# EAGLE design Lynx (EAGLE 6.4)
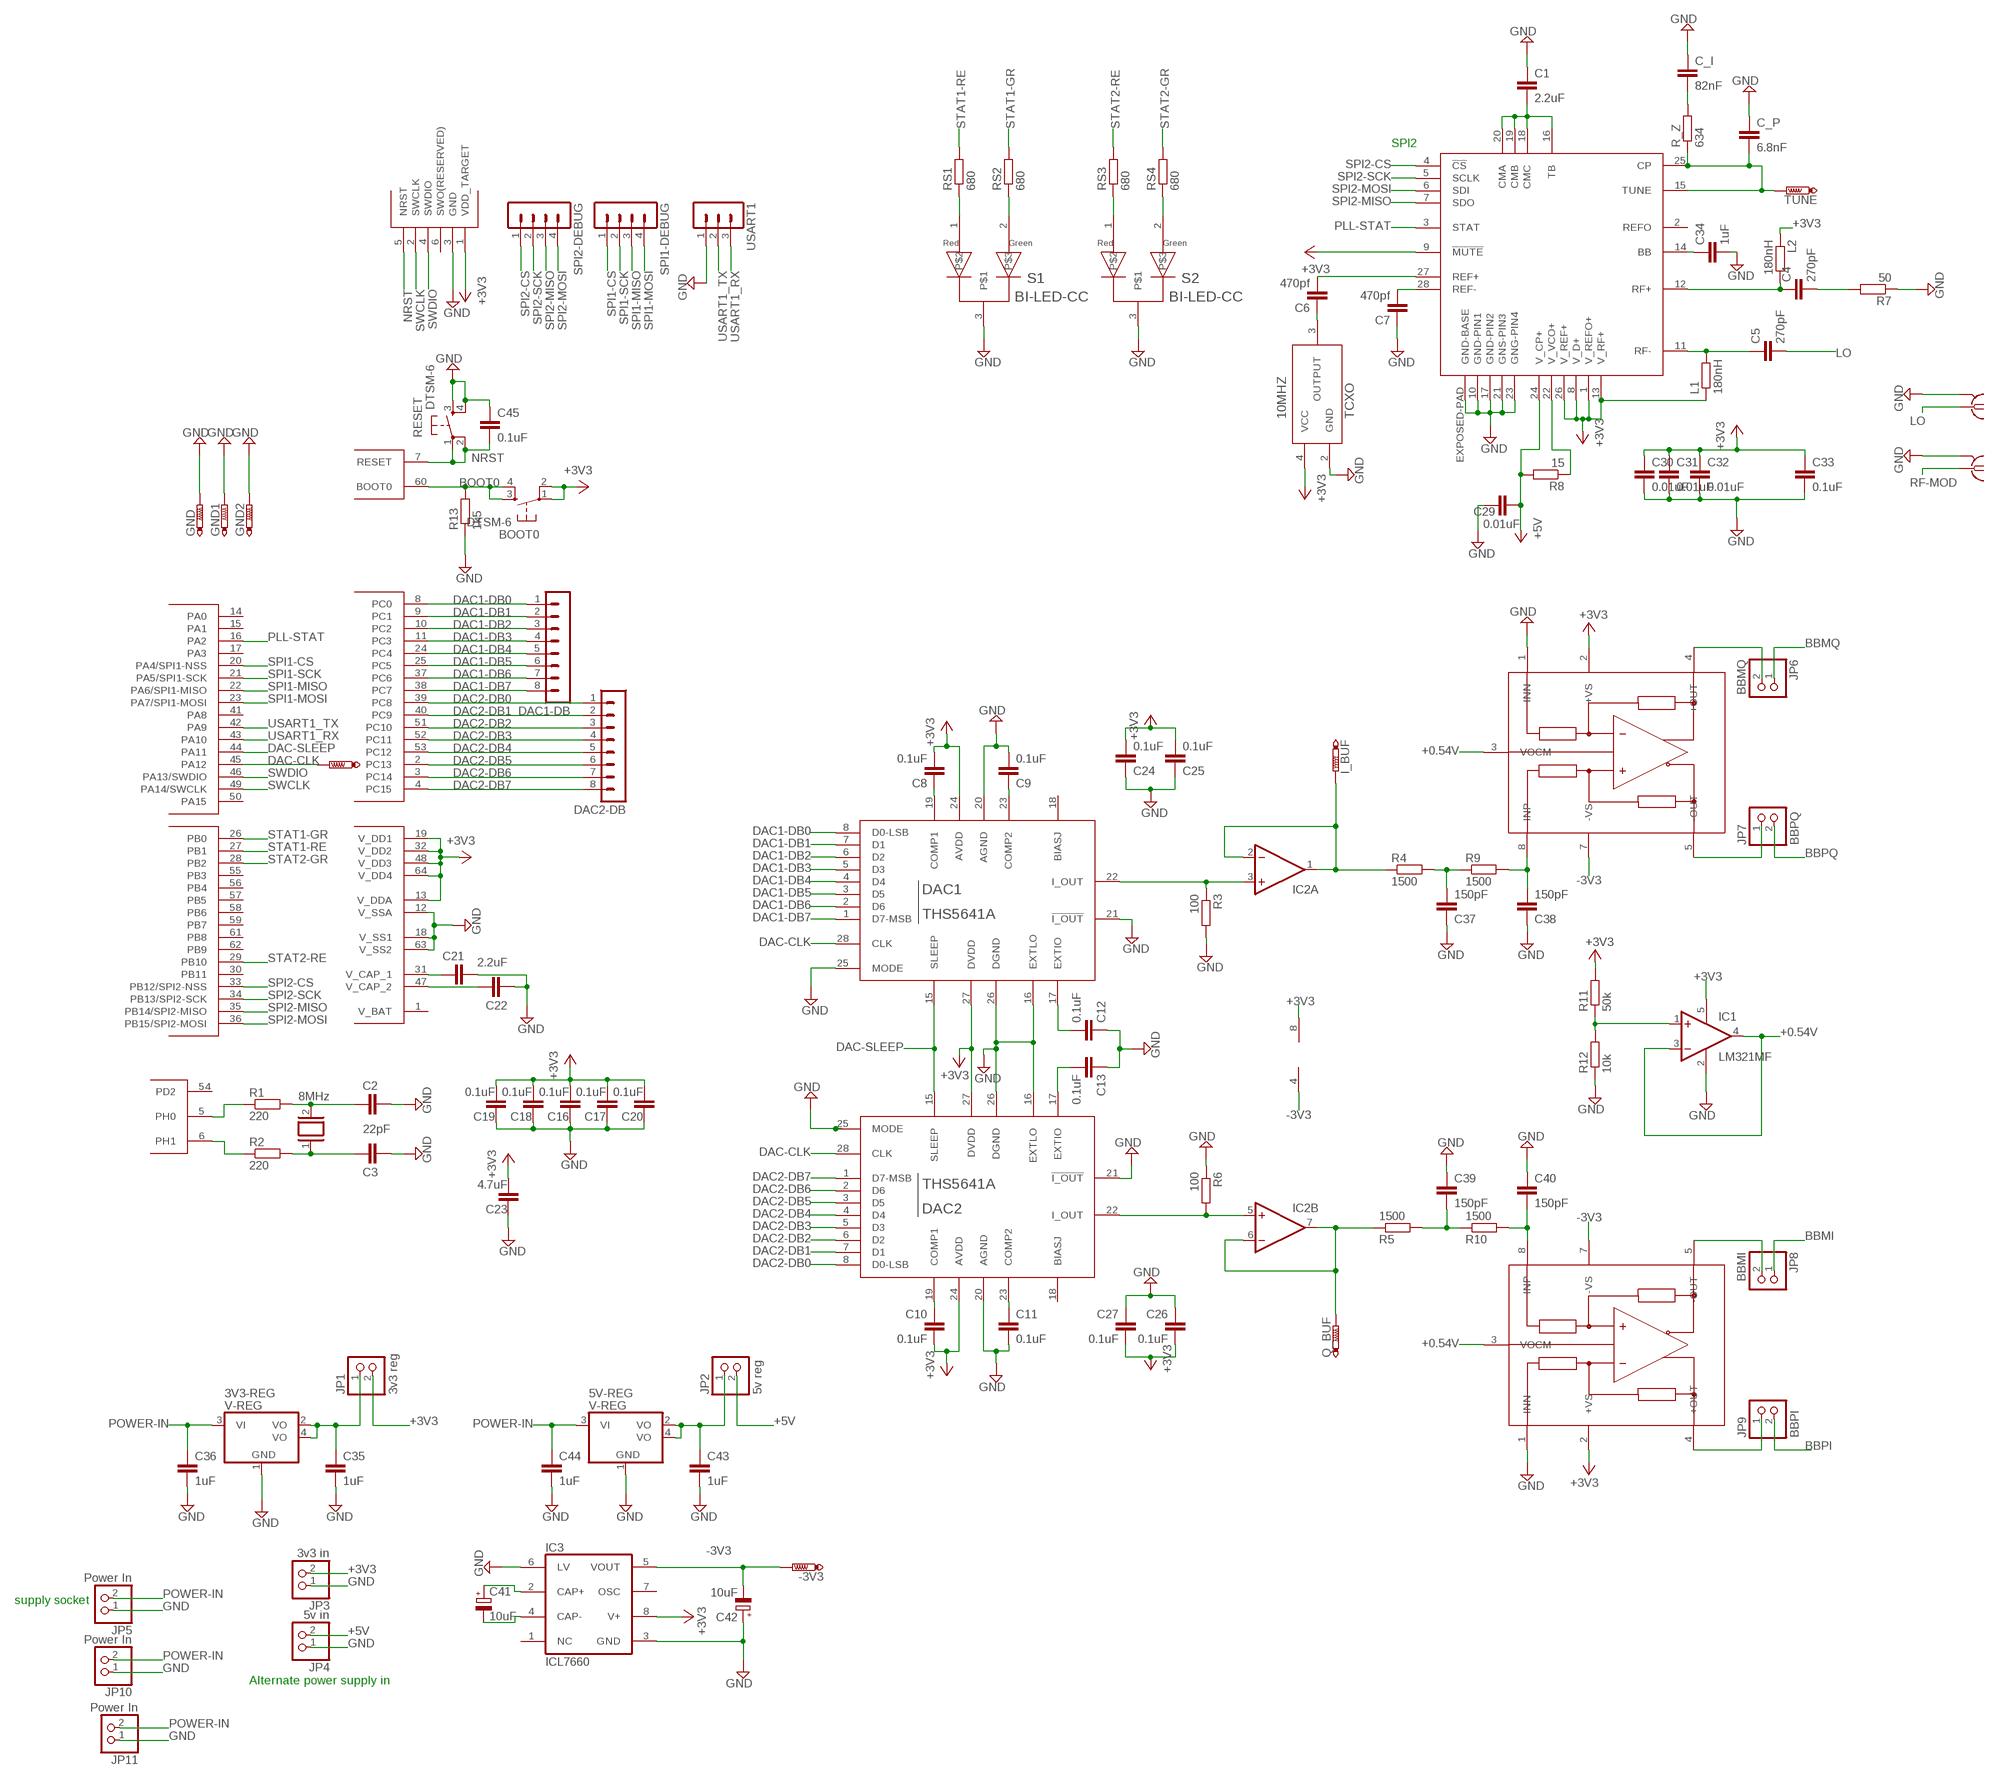
[diagram p0: schematic, sheet 1, part 1 of 2]
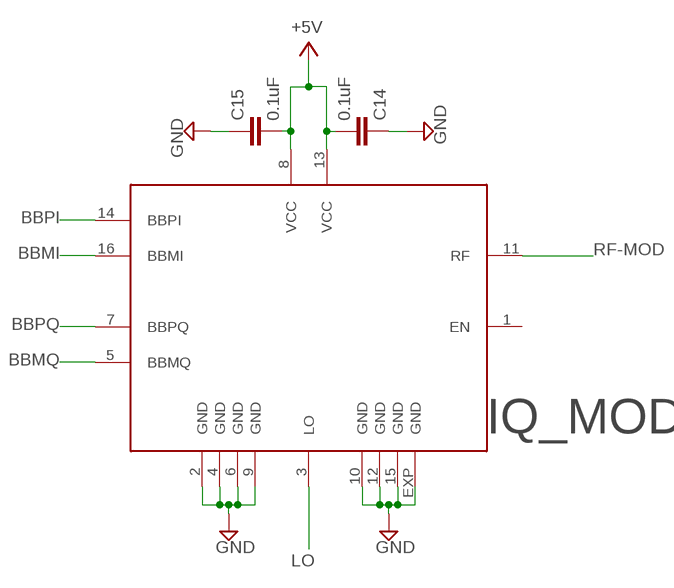
[diagram p1: schematic, sheet 1, part 2 of 2]

## Parts
3V3-REG  V-REG  VOLTAGE-REGULATOR  [SOT223]
5V-REG  V-REG  VOLTAGE-REGULATOR  [SOT223]
10MHZ  TCXO  [TXCO5.6]
-3V3  PTR1PAD1-13Y  [P1-13Y]
BOOT0  DTSM-6  [DTSM-6]
C1  2.2uF  C-EUC0603  [C0603]
C2  22pF  C-EUC0603  [C0603]
C3  22pF  C-EUC0603  [C0603]
C4  270pF  C-EUC0805  [C0805]
C5  270pF  C-EUC0805  [C0805]
C6  470pf  C-EUC0402  [C0402]
C7  470pf  C-EUC0402  [C0402]
C8  0.1uF  C-EUC0603  [C0603]
C9  0.1uF  C-EUC0603  [C0603]
C10  0.1uF  C-EUC0603  [C0603]
C11  0.1uF  C-EUC0603  [C0603]
C12  0.1uF  C-EUC0603  [C0603]
C13  0.1uF  C-EUC0603  [C0603]
C14  0.1uF  C-EUC0603  [C0603]
C15  0.1uF  C-EUC0603  [C0603]
C16  0.1uF  C-EUC0603  [C0603]
C17  0.1uF  C-EUC0603  [C0603]
C18  0.1uF  C-EUC0603  [C0603]
C19  0.1uF  C-EUC0603  [C0603]
C20  0.1uF  C-EUC0603  [C0603]
C21  2.2uF  C-EUC0603  [C0603]
C22  2.2uF  C-EUC0603  [C0603]
C23  4.7uF  C-EUC0603  [C0603]
C24  0.1uF  C-EUC0603  [C0603]
C25  0.1uF  C-EUC0603  [C0603]
C26  0.1uF  C-EUC0603  [C0603]
C27  0.1uF  C-EUC0603  [C0603]
C29  0.01uF  C-EUC0603  [C0603]
C30  0.01uF  C-EUC0603  [C0603]
C31  0.01uF  C-EUC0402  [C0402]
C32  0.01uF  C-EUC0603  [C0603]
C33  0.1uF  C-EUC0603  [C0603]
C34  1uF  C-EUC0603  [C0603]
C35  1uF  C-EUC0603  [C0603]
C36  1uF  C-EUC0603  [C0603]
C37  150pF  C-EUC0603  [C0603]
C38  150pF  C-EUC0603  [C0603]
C39  150pF  C-EUC0603  [C0603]
C40  150pF  C-EUC0603  [C0603]
C41  10uF  CPOL-EUSANYO_SMD_B6  [SANYO-OSCON_SMD_B6]
C42  10uF  CPOL-EUSANYO_SMD_B6  [SANYO-OSCON_SMD_B6]
C43  1uF  C-EUC0603  [C0603]
C44  1uF  C-EUC0603  [C0603]
C45  0.1uF  C-EUC0603  [C0603]
C_I  82nF  C-EUC1210  [C1210]
C_P  6.8nF  C-EUC0805  [C0805]
DAC1  THS5641A  [SO28]
DAC1-DB  MA08-1  [MA08-1]
DAC2  THS5641A  [SO28]
DAC2-DB  MA08-1  [MA08-1]
DAC-CLK  PTR1PAD1-13Y  [P1-13Y]
GND  PTR1PAD1-13Y  [P1-13Y]
GND1  PTR1PAD1-13Y  [P1-13Y]
GND2  PTR1PAD1-13Y  [P1-13Y]
I_BUF  PTR1PAD1-13Y  [P1-13Y]
IC1  LM321MF  [SOT23-5]
IC2  2AMP_P8+4D  [SO08]
IC3  ICL7660  ICL7660CSA  [SO08]
IQ_MOD  LT5568  [QFN-16]
JP1  3v3 reg  PINHD-1X2  [1X02]
JP2  5v reg  PINHD-1X2  [1X02]
JP3  3v3 in  PINHD-1X2  [1X02]
JP4  5v in  PINHD-1X2  [1X02]
JP5  Power In  PINHD-1X2  [1X02]
JP6  BBMQ  PINHD-1X2  [1X02]
JP7  BBPQ  PINHD-1X2  [1X02]
JP8  BBMI  PINHD-1X2  [1X02]
JP9  BBPI  PINHD-1X2  [1X02]
JP10  Power In  PINHD-1X2  [1X02]
JP11  Power In  PINHD-1X2  [1X02]
L1  180nH  R-EU_R0402  [R0402]
L2  180nH  R-EU_R0402  [R0402]
LO  SMA-142-0711-821/826  [J502-ND-142-0711-821/826]
Q1  8MHz  XTAL/S  [QS]
Q_BUF  PTR1PAD1-13Y  [P1-13Y]
R1  220  R-EU_R0603  [R0603]
R2  220  R-EU_R0603  [R0603]
R3  100  R-EU_R0603  [R0603]
R4  1500  R-EU_R0603  [R0603]
R5  1500  R-EU_R0603  [R0603]
R6  100  R-EU_R0603  [R0603]
R7  50  R-EU_R0805  [R0805]
R8  15  R-EU_R0603  [R0603]
R9  1500  R-EU_R0603  [R0603]
R10  1500  R-EU_R0603  [R0603]
R11  50k  R-EU_R0603  [R0603]
R12  10k  R-EU_R0603  [R0603]
R13  1k5  R-EU_R0603  [R0603]
R_Z  634  R-EU_R0805  [R0805]
RESET  DTSM-6  [DTSM-6]
RF-MOD  SMA-142-0711-821/826  [J502-ND-142-0711-821/826]
RS1  680  R-EU_R0603  [R0603]
RS2  680  R-EU_R0603  [R0603]
RS3  680  R-EU_R0603  [R0603]
RS4  680  R-EU_R0603  [R0603]
S1  BI-LED-CC  [SOT-23]
S2  BI-LED-CC  [SOT-23]
SPI1-DEBUG  MA04-1  [MA04-1]
SPI2-DEBUG  MA04-1  [MA04-1]
SWD-HEADER  SWD-HEADER  [6PIN-HEADER]
TUNE  PTR1B1,27  [B1,27]
U$1  STM32F415RGT6  [LQFP-64]
U$3  LTC6946  [QFN-28]
U$4  AD8476  [MSOP8]
U$5  AD8476  [MSOP8]
USART1  MA03-1  [MA03-1]

## Nets
5V-REG: 5V-REG.2(VO) 5V-REG.4(VO) C43.1 JP2.1
+0.54V: IC1.3(-IN) IC1.4(OUT) U$4.3(VOCM) U$5.3(VOCM)
+3V3: 10MHZ.4(VCC) BOOT0.1 BOOT0.2 C8.2 C10.2 C16.2 C17.2 C18.2 C19.2 C20.2 C23.2 C24.2 C25.2 C26.2 C27.2 C30.1 C31.1 C32.1 C33.1 DAC1.24(AVDD) DAC1.27(DVDD) DAC2.24(AVDD) DAC2.27(DVDD) IC1.5(V+) IC2.8(P:V+) IC3.8(V+) JP1.2 JP3.2 L1.1 L2.1 R11.2 SWD-HEADER.1(VDD_TARGET) U$1.13(POWER:V_DDA) U$1.19(POWER:V_DD1) U$1.32(POWER:V_DD2) U$1.48(POWER:V_DD3) U$1.64(POWER:V_DD4) U$3.1(V_REFO+) U$3.8(V_D+) U$3.9(!MUTE!) U$3.13(V_RF+) U$3.26(V_REF+) U$4.2(+VS) U$5.2(+VS)
+5V: C14.2 C15.2 C29.2 IQ_MOD.8(VCC) IQ_MOD.13(VCC) JP2.2 JP4.2 R8.2 U$3.24(V_CP+)
-3V3: -3V3.TP C42.- IC2.4(P:V-) IC3.5(VOUT) U$4.7(-VS) U$5.7(-VS)
BBMI: IQ_MOD.16(BBMI) JP8.1
BBMQ: IQ_MOD.5(BBMQ) JP6.1
BBPI: IQ_MOD.14(BBPI) JP9.2
BBPQ: IQ_MOD.7(BBPQ) JP7.2
BOOT0: BOOT0.3 BOOT0.4 R13.2 U$1.60(FUNCTIONS:BOOT0)
DAC1-DB0: DAC1-DB.1 DAC1.8(D0-LSB) U$1.8(PORT_C:PC0)
DAC1-DB1: DAC1-DB.2 DAC1.7(D1) U$1.9(PORT_C:PC1)
DAC1-DB2: DAC1-DB.3 DAC1.6(D2) U$1.10(PORT_C:PC2)
DAC1-DB3: DAC1-DB.4 DAC1.5(D3) U$1.11(PORT_C:PC3)
DAC1-DB4: DAC1-DB.5 DAC1.4(D4) U$1.24(PORT_C:PC4)
DAC1-DB5: DAC1-DB.6 DAC1.3(D5) U$1.25(PORT_C:PC5)
DAC1-DB6: DAC1-DB.7 DAC1.2(D6) U$1.37(PORT_C:PC6)
DAC1-DB7: DAC1-DB.8 DAC1.1(D7-MSB) U$1.38(PORT_C:PC7)
DAC2-DB0: DAC2-DB.1 DAC2.8(D0-LSB) U$1.39(PORT_C:PC8)
DAC2-DB1: DAC2-DB.2 DAC2.7(D1) U$1.40(PORT_C:PC9)
DAC2-DB2: DAC2-DB.3 DAC2.6(D2) U$1.51(PORT_C:PC10)
DAC2-DB3: DAC2-DB.4 DAC2.5(D3) U$1.52(PORT_C:PC11)
DAC2-DB4: DAC2-DB.5 DAC2.4(D4) U$1.53(PORT_C:PC12)
DAC2-DB5: DAC2-DB.6 DAC2.3(D5) U$1.2(PORT_C:PC13)
DAC2-DB6: DAC2-DB.7 DAC2.2(D6) U$1.3(PORT_C:PC14)
DAC2-DB7: DAC2-DB.8 DAC2.1(D7-MSB) U$1.4(PORT_C:PC15)
DAC-CLK: DAC1.28(CLK) DAC2.28(CLK) DAC-CLK.TP U$1.45(PORT_A:PA12)
DAC-SLEEP: DAC1.15(SLEEP) DAC2.15(SLEEP) U$1.44(PORT_A:PA11)
GND: 3V3-REG.1(GND) 5V-REG.1(GND) 10MHZ.2(GND) C1.1 C2.2 C3.2 C7.1 C9.2 C11.2 C12.1 C13.1 C14.1 C15.1 C16.1 C17.1 C18.1 C19.1 C20.1 C21.2 C22.2 C23.1 C24.1 C25.1 C26.1 C27.1 C29.1 C30.2 C31.2 C32.2 C33.2 C34.2 C35.2 C36.2 C37.1 C38.1 C39.1 C40.1 C42.+ C43.2 C44.2 C45.1 C_I.1 C_P.1 DAC1.16(EXTLO) DAC1.20(AGND) DAC1.21(!I_OUT!) DAC1.25(MODE) DAC1.26(DGND) DAC2.16(EXTLO) DAC2.20(AGND) DAC2.21(!I_OUT!) DAC2.25(MODE) DAC2.26(DGND) GND1.TP GND2.TP GND.TP IC1.2(V-) IC3.3(GND) IC3.6(LV) IQ_MOD.2(GND) IQ_MOD.4(GND) IQ_MOD.6(GND) IQ_MOD.9(GND) IQ_MOD.10(GND) IQ_MOD.12(GND) IQ_MOD.15(GND) IQ_MOD.EXP(GND) JP3.1 JP4.1 JP5.1 JP10.1 JP11.1 LO.G@1 LO.G@2 LO.G@3 LO.G@4 R3.2 R6.1 R7.1 R12.1 R13.1 RESET.3 RESET.4 RF-MOD.G@1 RF-MOD.G@2 RF-MOD.G@3 RF-MOD.G@4 S1.3 S2.3 SWD-HEADER.3(GND) U$1.12(POWER:V_SSA) U$1.18(POWER:V_SS1) U$1.63(POWER:V_SS2) U$3.10(GND-PIN1) U$3.17(GND-PIN2) U$3.21(GNS-PIN3) U$3.23(GNG-PIN4) U$3.EXPOSED-PAD(GND-BASE) U$4.1(INN) U$5.1(INN) USART1.1
I_BUF: I_BUF.TP IC2.1(A:OUT) IC2.2(A:-IN) R4.1
LO: C5.2 IQ_MOD.3(LO) LO.1
N$1: C_P.2 R_Z.1 TUNE.TP U$3.15(TUNE) U$3.25(CP)
N$2: C1.2 U$3.16(TB) U$3.18(CMC) U$3.19(CMB) U$3.20(CMA)
N$3: C7.2 U$3.28(REF-)
N$4: C3.1 Q1.1 R2.2
N$5: C2.1 Q1.2 R1.2
N$6: R1.1 U$1.5(PH0)
N$7: R2.1 U$1.6(PH1)
N$8: C5.1 L1.2 U$3.11(RF-)
N$10: C4.2 R7.2
N$11: C13.2 DAC2.17(EXTIO)
N$12: C8.1 DAC1.19(COMP1)
N$13: C12.2 DAC1.17(EXTIO)
N$14: DAC1.22(I_OUT) IC2.3(A:+IN) R3.1
N$15: JP6.2 U$4.4(+OUT)
N$16: RS1.1 S1.1
N$17: RS2.1 S1.2
N$18: RS3.1 S2.1
N$19: RS4.1 S2.2
N$20: C10.1 DAC2.19(COMP1)
N$21: C6.2 U$3.27(REF+)
N$22: 10MHZ.3(OUTPUT) C6.1
N$23: C_I.2 R_Z.2
N$24: C9.1 DAC1.23(COMP2)
N$25: C11.1 DAC2.23(COMP2)
N$26: C21.1 U$1.31(POWER:V_CAP_1)
N$27: C22.1 U$1.47(POWER:V_CAP_2)
N$28: JP7.1 U$4.5(-OUT)
N$29: DAC2.22(I_OUT) IC2.5(B:+IN) R6.2
N$30: R8.1 U$3.22(V_VCO+)
N$31: C37.2 R4.2 R9.1
N$32: C38.2 R9.2 U$4.8(INP)
N$33: C34.1 U$3.14(BB)
N$34: C41.- IC3.4(CAP-)
N$35: C39.2 R5.2 R10.1
N$36: C40.2 R10.2 U$5.8(INP)
N$37: C41.+ IC3.2(CAP+)
N$38: 3V3-REG.2(VO) 3V3-REG.4(VO) C35.1 JP1.1
N$39: JP8.2 U$5.5(-OUT)
N$40: JP9.1 U$5.4(+OUT)
N$42: IC1.1(+IN) R11.1 R12.2
NRST: C45.2 RESET.1 RESET.2 SWD-HEADER.5(NRST) U$1.7(FUNCTIONS:RESET)
PLL-STAT: U$1.16(PORT_A:PA2) U$3.3(STAT)
POWER-IN: 3V3-REG.3(VI) 5V-REG.3(VI) C36.1 C44.1 JP5.2 JP10.2 JP11.2
Q_BUF: IC2.6(B:-IN) IC2.7(B:OUT) Q_BUF.TP R5.1
RF+: C4.1 L2.2 U$3.12(RF+)
RF-MOD: IQ_MOD.11(RF) RF-MOD.1
SPI1-CS: SPI1-DEBUG.1 U$1.20(PORT_A:PA4/SPI1-NSS)
SPI1-MISO: SPI1-DEBUG.3 U$1.22(PORT_A:PA6/SPI1-MISO)
SPI1-MOSI: SPI1-DEBUG.4 U$1.23(PORT_A:PA7/SPI1-MOSI)
SPI1-SCK: SPI1-DEBUG.2 U$1.21(PORT_A:PA5/SPI1-SCK)
SPI2-CS: SPI2-DEBUG.1 U$1.33(PORT_B:PB12/SPI2-NSS) U$3.4(!CS!)
SPI2-MISO: SPI2-DEBUG.3 U$1.35(PORT_B:PB14/SPI2-MISO) U$3.7(SDO)
SPI2-MOSI: SPI2-DEBUG.4 U$1.36(PORT_B:PB15/SPI2-MOSI) U$3.6(SDI)
SPI2-SCK: SPI2-DEBUG.2 U$1.34(PORT_B:PB13/SPI2-SCK) U$3.5(SCLK)
STAT1-GR: RS2.2 U$1.26(PORT_B:PB0)
STAT1-RE: RS1.2 U$1.27(PORT_B:PB1)
STAT2-GR: RS4.2 U$1.28(PORT_B:PB2)
STAT2-RE: RS3.2 U$1.29(PORT_B:PB10)
SWCLK: SWD-HEADER.2(SWCLK) U$1.49(PORT_A:PA14/SWCLK)
SWDIO: SWD-HEADER.4(SWDIO) U$1.46(PORT_A:PA13/SWDIO)
USART1_RX: U$1.43(PORT_A:PA10) USART1.3
USART1_TX: U$1.42(PORT_A:PA9) USART1.2
Unconnected: DAC1.18(BIASJ) DAC2.18(BIASJ) IC3.1(NC) IC3.7(OSC) IQ_MOD.1(EN) SWD-HEADER.6(SWO(RESERVED)) U$1.1(POWER:V_BAT) U$1.14(PORT_A:PA0) U$1.15(PORT_A:PA1) U$1.17(PORT_A:PA3) U$1.30(PORT_B:PB11) U$1.41(PORT_A:PA8) U$1.50(PORT_A:PA15) U$1.54(PD2) U$1.55(PORT_B:PB3) U$1.56(PORT_B:PB4) U$1.57(PORT_B:PB5) U$1.58(PORT_B:PB6) U$1.59(PORT_B:PB7) U$1.61(PORT_B:PB8) U$1.62(PORT_B:PB9) U$3.2(REFO)

## Notes on the sheet
- SPI2
- supply socket
- Alternate power supply in

## Library data of the parts
3V3-REG 5V-REG = Lynx components:VOLTAGE-REGULATOR
10MHZ = Lynx components:TCXO
-3V3 DAC-CLK GND GND1 GND2 I_BUF Q_BUF TUNE = testpad:PTR1: TEST PIN
BOOT0 RESET = switch-tact:DTSM-6
C1 C4-C20 C23-C27 C29-C40 C43-C45 C_I = rcl:C-EU: CAPACITOR, European symbol
C2 C3 C21 C22 C_P = resistor:C-EU: CAPACITOR, European symbol
C41 C42 = rcl:CPOL-EU: POLARIZED CAPACITOR, European symbol
DAC1 DAC2 = Lynx components:THS5641A
DAC1-DB DAC2-DB = con-lstb:MA08-1: PIN HEADER; OC_FARNELL: unknown; OC_NEWARK: unknown
IC1 = linear:LM321?*: Low Power Single Op Amp Source: http://cache.national.com/ds/LM/LM321.pdf
IC2 = linear:2AMP_P8+4: OP AMP
IC3 = maxim:ICL7660CSA: VOLTAGE CONVERTER; MF: MAXIM; MPN: ICL7660CSA; OC_FARNELL: 9724710; OC_NEWARK: 34C3732
IQ_MOD = Lynx components:LT5568
JP1-JP11 = pinhead:PINHD-1X2: PIN HEADER
L1 L2 R7 R8 R_Z = rcl:R-EU_: RESISTOR, European symbol
LO RF-MOD = con-coax:SMA-: SMA 50 Ohm End Launch Jack Receptacle - Round Contact Johnson Components Source: www.johnsoncomponents.com .. J502-ND.pdf; MF: JOHNSON COMPONENTS; MPN: 142-0711-821; OC_FARNELL: 1019328; OC_NEWARK: 16F3627
Q1 = special:XTAL/S: CRYSTAL
R1-R6 R9-R13 RS1-RS4 = resistor:R-EU_: RESISTOR, European symbol
S1 S2 = Lynx components:BI-LED-CC
SPI1-DEBUG SPI2-DEBUG = con-lstb:MA04-1: PIN HEADER; OC_FARNELL: unknown; OC_NEWARK: unknown
SWD-HEADER = Lynx components:SWD-HEADER
U$1 = Lynx components:STM32F415RGT6
U$3 = Lynx components:LTC6946
U$4 U$5 = Lynx components:AD8476
USART1 = con-lstb:MA03-1: PIN HEADER; OC_FARNELL: unknown; OC_NEWARK: unknown

## Board
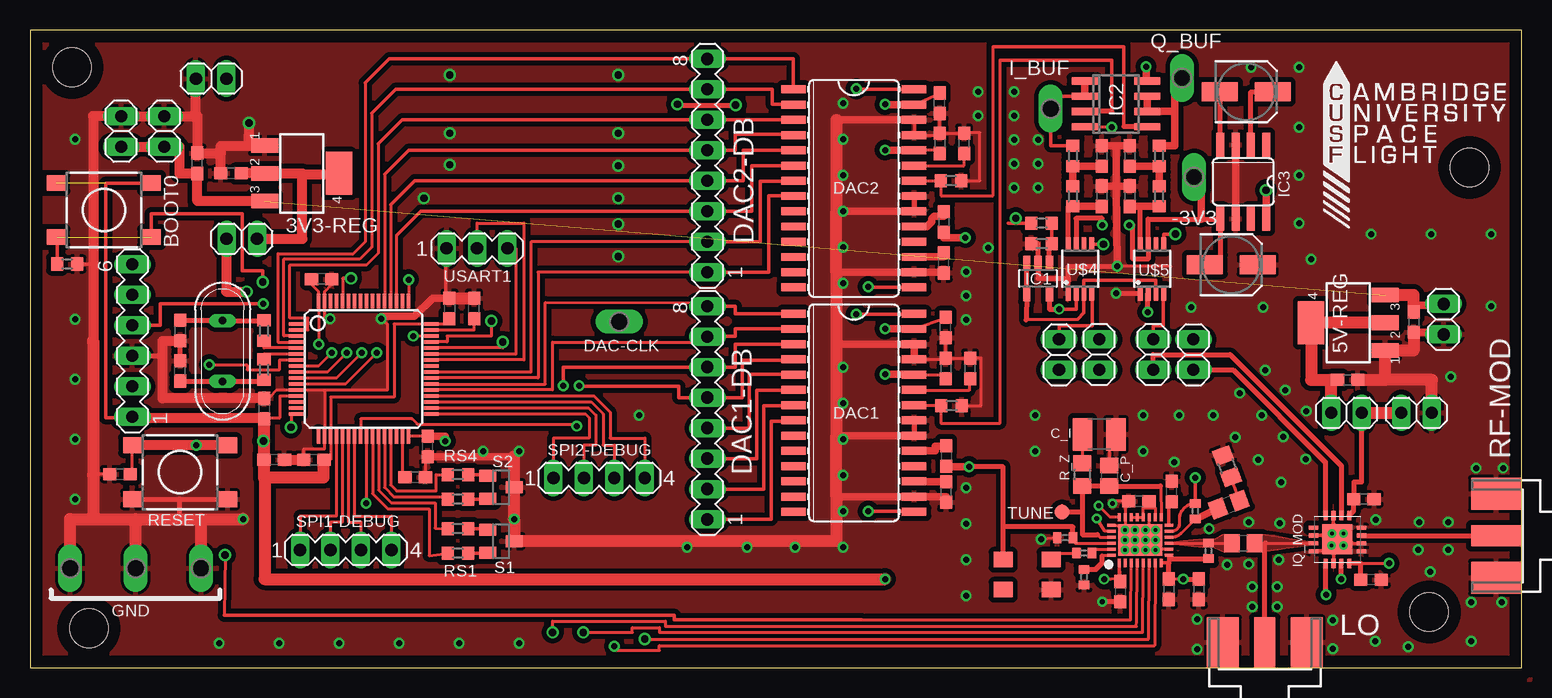
[diagram p2: board, top side]
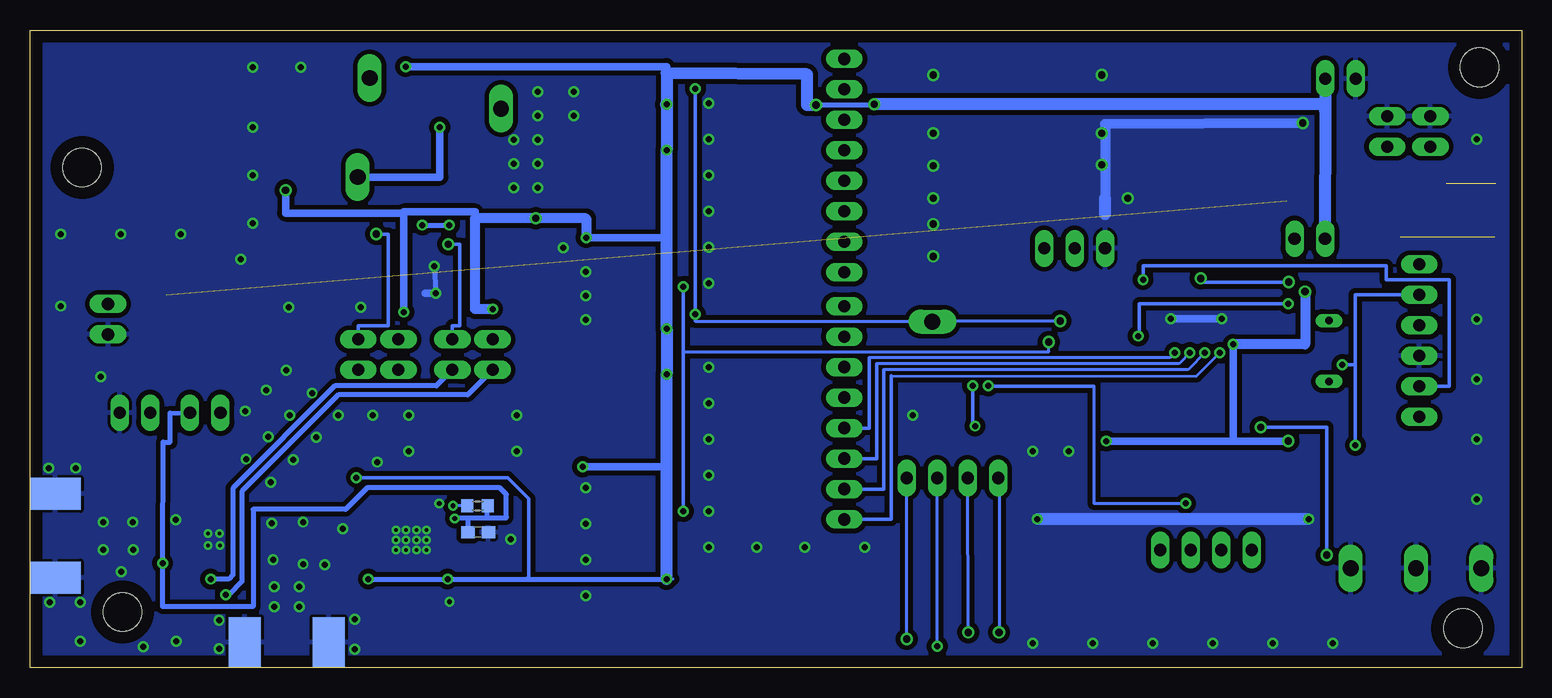
[diagram p3: board, bottom side, seen from below]

Size 124.3 x 53.15 mm. Coordinates in mm from the lower left corner, seen from the top.
Outline: 0,0 124.3,0 124.3,53.15 0,53.15 0,0
Copper layers (1*16): Top 0.035mm / dielectric 1.5mm / Bottom 0.035mm
Design rules "default *": minimum track width 0.2mm, minimum drill 0.2mm, track to track 0.2mm, track to pad 0.2mm, pad to pad 0.2mm, via to via 0.25mm, smd to smd 5mil, copper to edge 40mil, drill to drill 8mil, minimum pad ring 10mil, minimum via ring 8mil, stop-mask expansion 4mil, vias tented up to drill 0mil, thermal gap 10mil
Holes 3.2 mm at 4.9,3.3 119.95,41.7 116.6,4.65 3.5,50.05

### Footprints (pad centres in the part's own frame; a part is rotated, then mirrored left to right if it is on the bottom)
SOT223 = smd 1.219 x 2.235: 1 -2.311,-3.099; 2 0,-3.099; 3 2.311,-3.099 | smd 3.6 x 2.2: 4 0,3.099
TXCO5.6 = smd 1.6 x 1.3: 1 -2,-1.25; 2 2,-1.25; 3 2,1.25; 4 -2,1.25
P1-13Y = drill 1.321 pad 1.905 long: TP 0,0
DTSM-6 = smd 1.55 x 1.3: 1 -3.975,2.25; 2 3.975,2.25; 3 -3.975,-2.25; 4 3.975,-2.25
C0603 = smd 1.1 x 1: 1 -0.85,0; 2 0.85,0
C0805 = smd 1.3 x 1.5: 1 -0.95,0; 2 0.95,0
C0402 = smd 0.7 x 0.9: 1 -0.65,0; 2 0.65,0
SANYO-OSCON_SMD_B6 = smd 3 x 1.6: + 2.2,0; - -2.2,0
C1210 = smd 1.6 x 2.7: 1 -1.4,0; 2 1.4,0
C0805' = smd 1.3 x 1.5: 1 -0.85,0; 2 0.85,0
SO28 = smd 0.66 x 2.032: 1 -8.255,-5.029; 2 -6.985,-5.029; 3 -5.715,-5.029; 4 -4.445,-5.029; 5 -3.175,-5.029; 6 -1.905,-5.029; 7 -0.635,-5.029; 8 0.635,-5.029; 9 1.905,-5.029; 10 3.175,-5.029; 11 4.445,-5.029; 12 5.715,-5.029; 13 6.985,-5.029; 14 8.255,-5.029; 15 8.255,5.029; 16 6.985,5.029; 17 5.715,5.029; 18 4.445,5.029; 19 3.175,5.029; 20 1.905,5.029; 21 0.635,5.029; 22 -0.635,5.029; 23 -1.905,5.029; 24 -3.175,5.029; 25 -4.445,5.029; 26 -5.715,5.029; 27 -6.985,5.029; 28 -8.255,5.029
MA08-1 = drill 1.016 long: 1 -8.89,0; 2 -6.35,0; 3 -3.81,0; 4 -1.27,0; 5 1.27,0; 6 3.81,0; 7 6.35,0; 8 8.89,0
SOT23-5 = smd 0.6 x 1.2: 1 -0.95,-1.306; 2 0,-1.306; 3 0.95,-1.306; 4 0.95,1.306; 5 -0.95,1.306
SO08 = smd 0.6 x 2.2: 1 -1.905,-2.6; 2 -0.635,-2.6; 3 0.635,-2.6; 4 1.905,-2.6; 5 1.905,2.6; 6 0.635,2.6; 7 -0.635,2.6; 8 -1.905,2.6
SO08' = smd 0.66 x 2.032: 1 -1.905,-3.073; 2 -0.635,-3.073; 3 0.635,-3.073; 4 1.905,-3.073; 5 1.905,3.073; 6 0.635,3.073; 7 -0.635,3.073; 8 -1.905,3.073
QFN-16 = smd 0.8 x 0.35: 1 -2,0.975; 2 -2,0.325; 3 -2,-0.325; 4 -2,-0.975; 9 2,-0.975; 10 2,-0.325; 11 2,0.325; 12 2,0.975 | smd 0.35 x 0.8: 5 -0.975,-2; 6 -0.325,-2; 7 0.325,-2; 8 0.975,-2; 13 0.975,2; 14 0.325,2; 15 -0.325,2; 16 -0.975,2 | smd 2.5 x 2.5: EXP 0,0
1X02 = drill 1.016 long: 1 -1.27,0; 2 1.27,0
R0402 = smd 0.7 x 0.9: 1 -0.65,0; 2 0.65,0
J502-ND-142-0711-821/826 = smd 4.191 x 1.778: 1 2.115,0 | smd 4.191 x 2.667: G@1 2.115,3.495; G@2 2.115,-3.495 | smd 4.191 x 2.667 bottom: G@3 2.115,3.495; G@4 2.115,-3.495
QS = drill 0.61 long: 1 -2.54,0; 2 2.54,0
R0603 = smd 1 x 1.1: 1 -0.85,0; 2 0.85,0
R0805 = smd 1.3 x 1.5: 1 -0.95,0; 2 0.95,0
SOT-23 = smd 1 x 1.4: 1 -0.95,-1.1; 2 0.95,-1.1; 3 0,1.1
MA04-1 = drill 1.016 long: 1 -3.81,0; 2 -1.27,0; 3 1.27,0; 4 3.81,0
6PIN-HEADER = drill 1.016 long: 1 -6.35,0; 2 -3.81,0; 3 -1.27,0; 4 1.27,0; 5 3.81,0; 6 6.35,0
B1,27 = smd 1.27 x 1.27: TP 0,0
LQFP-64 = smd 1.2 x 0.3: 1 -5.65,3.75; 2 -5.65,3.25; 3 -5.65,2.75; 4 -5.65,2.25; 5 -5.65,1.75; 6 -5.65,1.25; 7 -5.65,0.75; 8 -5.65,0.25; 9 -5.65,-0.25; 10 -5.65,-0.75; 11 -5.65,-1.25; 12 -5.65,-1.75; 13 -5.65,-2.25; 14 -5.65,-2.75; 15 -5.65,-3.25; 16 -5.65,-3.75; 33 5.65,-3.75; 34 5.65,-3.25; 35 5.65,-2.75; 36 5.65,-2.25; 37 5.65,-1.75; 38 5.65,-1.25; 39 5.65,-0.75; 40 5.65,-0.25; 41 5.65,0.25; 42 5.65,0.75; 43 5.65,1.25; 44 5.65,1.75; 45 5.65,2.25; 46 5.65,2.75; 47 5.65,3.25; 48 5.65,3.75 | smd 0.3 x 1.2: 17 -3.75,-5.65; 18 -3.25,-5.65; 19 -2.75,-5.65; 20 -2.25,-5.65; 21 -1.75,-5.65; 22 -1.25,-5.65; 23 -0.75,-5.65; 24 -0.25,-5.65; 25 0.25,-5.65; 26 0.75,-5.65; 27 1.25,-5.65; 28 1.75,-5.65; 29 2.25,-5.65; 30 2.75,-5.65; 31 3.25,-5.65; 32 3.75,-5.65; 49 3.75,5.65; 50 3.25,5.65; 51 2.75,5.65; 52 2.25,5.65; 53 1.75,5.65; 54 1.25,5.65; 55 0.75,5.65; 56 0.25,5.65; 57 -0.25,5.65; 58 -0.75,5.65; 59 -1.25,5.65; 60 -1.75,5.65; 61 -2.25,5.65; 62 -2.75,5.65; 63 -3.25,5.65; 64 -3.75,5.65
QFN-28 = smd 0.25 x 0.7: 1 -1.83,-1.9; 2 -1.33,-1.9; 3 -0.83,-1.9; 4 -0.33,-1.9; 5 0.17,-1.9; 6 0.67,-1.9; 7 1.17,-1.9; 8 1.67,-1.9; 15 1.67,1.9; 16 1.17,1.9; 17 0.67,1.9; 18 0.17,1.9; 19 -0.33,1.9; 20 -0.83,1.9; 21 -1.33,1.9; 22 -1.83,1.9 | smd 0.7 x 0.25: 9 2.32,-1.25; 10 2.32,-0.75; 11 2.32,-0.25; 12 2.32,0.25; 13 2.32,0.75; 14 2.32,1.25; 23 -2.48,1.25; 24 -2.48,0.75; 25 -2.48,0.25; 26 -2.48,-0.25; 27 -2.48,-0.75; 28 -2.48,-1.25 | smd 3.65 x 2.65: EXPOSED-PAD -0.07,0
MSOP8 = smd 0.4 x 1.2: 1 -0.975,-2.05; 2 -0.325,-2.05; 3 0.325,-2.05; 4 0.975,-2.05; 5 0.975,2.05; 6 0.325,2.05; 7 -0.325,2.05; 8 -0.975,2.05
MA03-1 = drill 1.016 long: 1 -2.54,0; 2 0,0; 3 2.54,0

### Placement (x,y rotation side)
3V3-REG  22.65,41.2 270 top
5V-REG  109.85,28.75 90 top
10MHZ  83.09,7.76 0 top
-3V3  97,40.9 0 top
BOOT0  6.15,38.15 0 top
C1  92.4,13.9 0 top
C2  12.5,28.1 270 top
C3  12.5,24.75 90 top
C4  99.9,13.6 20 top
C5  101.1,10.4 0 top
C6  87.84,9.56 0 top
C7  87.84,7.54 90 top
C8  76.35,17.65 270 top
C9  78.35,24.95 90 top
C10  76.15,37.15 270 top
C11  77.85,43.7 90 top
C12  76.35,14.65 90 top
C13  76.15,33.75 90 top
C14  111.15,14.05 180 top
C15  111.75,7.35 180 top
C16  24.3,32.4 180 top
C17  34.95,29.95 270 top
C18  23.65,17.35 0 top
C19  33.15,18.45 90 top
C20  19.5,21.6 270 top
C21  32.1,15.9 0 top
C22  37,29.95 90 top
C23  20.35,17.35 180 top
C24  76.3,24.95 270 top
C25  76.3,28.35 90 top
C26  75.8,43.7 270 top
C27  75.8,47.05 90 top
C29  86.95,11.3 180 bottom
C30  94.9,6.55 270 top
C31  86.25,10.85 180 top
C32  90.85,6.35 270 top
C33  97.4,6.55 270 top
C34  95.15,14.7 90 top
C35  16.75,41.2 180 top
C36  13.95,42.05 90 top
C37  89.3,42.65 270 top
C38  89.3,39.3 270 top
C39  91.65,42.65 270 top
C40  91.65,39.3 270 top
C41  101.35,48 0 top
C42  100.1,33.6 0 top
C43  109.8,24 0 top
C44  115.3,28.8 270 top
C45  7.5,16.15 0 top
C_I  89.1,19.45 180 top
C_P  6.8nF  [C0805']  89.95,16 270 top
DAC1  68.65,21.25 270 top
DAC1-DB  56.45,21.25 90 top
DAC2  68.65,39.95 270 top
DAC2-DB  56.45,41.85 90 top
DAC-CLK  49.1,28.85 90 top
GND  14.25,8.3 0 top
GND1  8.8,8.3 0 top
GND2  3.35,8.3 0 top
I_BUF  85.05,46.6 0 top
IC1  84,32.45 180 top
IC2  90.5,47 270 top
IC3  ICL7660  [SO08']  101.1,40.5 180 top
IQ_MOD  108.95,10.7 0 top
JP1  17.65,35.75 180 top
JP2  109.7,21.25 0 top
JP3  15.1,49.1 0 top
JP4  115.55,21.25 180 top
JP5  7.6,44.7 270 top
JP6  85.75,26.1 90 top
JP7  89.1,26.1 270 top
JP8  96.95,26.1 90 top
JP9  93.6,26.1 270 top
JP10  117.8,29.05 90 top
JP11  11.2,44.7 270 top
L1  98.2,9.75 90 top
L2  97.1,13.05 270 top
LO  102.9,0 90 top
Q1  16.05,26.4 90 top
Q_BUF  96,49.15 0 top
R1  19.5,28.1 90 top
R2  19.5,24.85 270 top
R3  76.8,21.85 0 top
R4  86.9,42.65 270 top
R5  94.1,42.65 270 top
R6  76.75,40.6 180 top
R7  99.75,16.8 290 top
R8  87,13.5 0 bottom
R9  86.9,39.3 270 top
R10  94.1,39.3 270 top
R11  84.3,37.05 180 top
R12  84.3,35.35 0 top
R13  3.1,33.65 180 top
R_Z  87.7,16.1 90 top
RESET  12.5,16.3 0 top
RF-MOD  124.3,11 180 top
RS1  35.65,11.6 180 top
RS2  35.65,9.55 180 top
RS3  35.65,16.1 180 top
RS4  35.65,14.05 180 top
S1  39.25,10.55 270 top
S2  39.25,15.05 270 top
SPI1-DEBUG  26.31,9.82 0 top
SPI2-DEBUG  47.43,15.82 0 top
SWD-HEADER  8.53,27.27 90 top
TUNE  86,13 0 top
U$1  27.8,24.91 0 top
U$2  [CUSF_LOGO]  107.6,36.55 0 top
U$3  92.59,10.65 0 top
U$4  87.5,33.25 0 top
U$5  93.5,33.25 0 top
USART1  37.25,34.95 0 top

### Tracks (layer width: path | path; a pad name or v marks a point on that pad's centre or on a via)
5V-REG
  Top 1.016: 5V-REG.2 5V-REG.4 106.75,24 108.43,24 | 108.43,24 C43.1 | JP2.1 108.43,24
+0.54V
  Top 0.305: U$5.3 93.83,32.3 87.83,32.3 U$4.3 87.83,29.57 87.3,29.05 83,29
  Top 0.406: IC1.3 IC1.4 83,29
+3V3  (via drill 0.5, 0.6)  (1 unrouted)
  Top 0.254: 19.55,20.85 20.85,20.85 20.85,22.66 U$1.13 | C18.2 25.05,17.35 U$1.19 25.05,22.55 30.35,22.55 30.35,28.65 34.65,28.65 34.65,28.66 | C19.2 31.55,19.3 U$1.32 | U$1.48 34.65,28.66 | v24.05,26.95 U$1.64 24.05,31.35 23.45,31.95 C16.2 | C17.2 34.65,28.66 | C26.2 75.8,43.12 DAC2.24 | DAC2.27 75.8,47.88 C27.2 | DAC1.27 76.3,29.18 C25.2 | DAC1.24 76.3,24.43 C24.2 | C32.1 90.76,7.65 U$3.1 90.81,7.41 90.1,7.4 v89.5,7.4 | C31.1 87.1,10.4 U$3.26 | U$3.13 95.16,11.4 arc90 95.8,12.04 95.8,12.4 arc-90 L2.1 | v96.1,7.4 C30.1
  Top 0.305: C8.2 76.35,16.75 | 73.68,24.45 DAC1.24 | DAC1.27 73.68,28.25 | C10.2 76.15,35.85 | 73.68,43.15 DAC2.24 | 71.25,46.94 v71.25,46.95 | C18.2 24.45,17.35 | BOOT0.2 6.3,40.4 6.3,20.85 8.53,20.85 | 81.5,37.05 R11.2 82.15,37.05 v82.15,37.45 | v85.75,29.9 87.17,29.9 U$4.2 | U$3.8 94.91,8.75 U$3.9 94.95,9.4 94.95,9.1 | C30.1 94.91,7.65 | L2.1 v97.1,15.85
  Top 0.406: 34.6,19.3 v34.6,18.9 | 19.65,19.25 19.5,19.15 | U$4.2 87.17,30.85 | v93.15,29.65 93.15,31.2 U$5.2 | IC2.8 93,48.91 | v53.95,46.95 53.95,46.9 v58.8,46.9 | 8.55,20.85 8.53,20.85 SWD-HEADER.1 | 94.91,7.65 94.91,8.75 | 94.95,9.1 L1.1 | 10MHZ.4 81.09,11.75 | 81.09,11.75 81.09,16.75 v78.25,16.75 | C31.1 86.9,11.75 81.09,11.75 | v96.1,7.4 C33.1 | IC1.5 84.95,29.9 v85.75,29.9
  Top 0.61: 76.35,16.75 v78.25,16.75 | v71.25,24.45 73.68,24.45 | 73.68,28.25 v71.25,28.25 | 76.15,35.85 v77.95,35.85 | v71.25,43.15 73.68,43.15 | DAC2.27 71.25,46.94 | C19.2 34.6,19.3 | 93,48.91 v93,50.1 | IC3.8 v103,39.8 | v19.45,18.9 19.5,19.25 19.5,18.5
  Top 0.813: 8.55,20.85 19.55,20.85 C20.2 | 19.55,15.85 19.5,15.85 | JP1.2 16.35,35.95 16.35,31.35 v18.05,31.35
  Top 1.016: C20.2 19.5,19.15 19.5,18.5 C23.2 19.5,15.85 | 24.45,17.35 24.45,15.85 19.55,15.85 19.55,7.4 v71.25,7.4
  Bottom 0.254: v89.5,7.4 v96.1,7.4 | 70.7,7.4 v71.25,7.4 | 82.75,7.55 82.9,7.4
  Bottom 0.305: v71.25,46.95 71.25,46.94 | 87.2,37.45 87.2,37.3 | v97.1,15.85 84.5,15.85 82.75,14.1 82.75,7.55
  Bottom 0.406: 71.25,47.5 v71.25,46.95 71.25,46.6 | v53.95,46.95 53.95,46.9 58.85,46.9 | v58.8,46.9 59.05,47.1 59.6,47.1 | v96.1,7.4 82.9,7.4 v71.25,7.4
  Bottom 0.61: v78.25,16.75 71.25,16.75 | v77.95,35.85 71.25,35.85 | v34.6,18.9 24.05,18.9 | v24.05,26.95 24.05,18.9 | 87.2,37.3 87.2,38 93.15,38 93.15,37.9 | 93.15,37.9 v93.15,29.65 | v93,50.1 71.25,50.1 71.25,49.55 | v103,39.8 103,37.9 93.15,37.9 | 24.05,18.9 v19.45,18.9
  Bottom 0.813: v85.75,29.9 87.2,29.9 87.2,37.3 | v77.95,35.85 77.95,37.45 v82.15,37.45 87.2,37.45 | v18.05,31.35 18.05,26.95 v24.05,26.95
  Bottom 1.016: 71.25,46.94 v71.25,43.15 71.25,35.85 v71.25,28.25 v71.25,24.45 71.25,16.75 v71.25,7.4 | JP1.2 16.33,46.45 | 16.33,46.45 16.33,46.95 v53.95,46.95 | 58.85,46.9 v58.8,46.9 59.55,46.9 59.55,49.45 71.25,49.55 v71.25,46.95 71.3,46.95 | JP3.2 16.37,46.45 16.33,46.45
+5V  (via drill 0.4, 0.5)
  Top 0.254: 109.95,12.7 IQ_MOD.13 | U$3.24 89.55,11.4 v88.9,12.45
  Top 0.305: 110.9,8.68 v113.25,8.71
  Top 0.406: IQ_MOD.13 110.3,13.07 C14.2 110.35,14.05 110.35,15.5 110.97,15.5 JP2.2 | C15.2 110.9,8.68 IQ_MOD.8
  Top 1.016: JP2.2 JP4.2
  Bottom 0.254: 86.2,13.45 R8.2 86.45,13.8
  Bottom 0.406: 86.2,12.5 86.2,13.45 | JP2.2 112.62,21.23 112.62,18.8 113.2,18.8 v113.25,8.71 113.25,5.1 105.7,5.1 105.7,13.2 98,13.2 96.2,15 85.15,15 84.6,14.45 84.6,12.55 84.65,12.5 86.2,12.5 | C29.2 87.8,12.45 | 87.8,12.45 v88.9,12.45 | 87.8,12.45 87.8,12.5 86.2,12.5
-3V3  (via drill 0.5)
  Top 0.254: 87.2,35.3 U$4.7 | IC2.4 90.15,45.09 v90.15,45.05
  Top 0.406: 99.19,37.4 97.6,37.4 93.17,37.4 U$5.7 93.17,34.05 91.9,34.05 91.9,36.9 v91.6,36.9 | 99.19,37.4 IC3.5 | 99.19,37.4 99.19,33.6 C42.- | v89.35,36.9 89.35,37.45 87.17,37.45 U$4.7
  Top 0.61: -3V3.TP 97.6,40.9 97.6,37.4 | v90.15,45.05 90.15,45.1
  Bottom 0.406: v91.6,36.9 v89.35,36.9
  Bottom 0.61: -3V3.TP 90.15,40.9 v90.15,45.05
BBMI
  Top 0.406: IQ_MOD.16 107.95,12.72 107.95,13.5 107.95,14.2 107.95,17.15 100.27,24.83 JP8.1
BBMQ  (via drill 0.5)
  Top 0.406: v108,6.1 107.97,6.12 IQ_MOD.5
  Bottom 0.406: JP6.1 87.83,22.75 98.6,22.75 106.65,14.7 106.65,7.2 107.75,6.1 v108,6.1
BBPI
  Top 0.406: JP9.2 93.6,26.1 100,26.1 109.28,16.82 IQ_MOD.14
BBPQ  (via drill 0.5)
  Top 0.406: v109.25,7.4 109.28,7.42 IQ_MOD.7
  Bottom 0.406: JP7.2 90.43,23.5 98.9,23.5 107.4,14.95 107.4,7.75 107.75,7.4 v109.25,7.4
BOOT0  (via drill 0.6)  (1 unrouted)
  Top 0.254: v26.75,32.45 26.05,32.45 U$1.60
  Top 0.305: BOOT0.3 2.25,35.9 R13.2 | BOOT0.4 10.1,35.9 10.1,37.85 17.7,37.85 17.7,33.1 19.4,33.1 v19.4,32.15
  Bottom 0.305: v19.4,32.15 26.75,32.15 v26.75,32.45
DAC1-DB0  (via drill 0.5)
  Top 0.254: U$1.8 24.06,25.16 v25.15,26.25
  Top 0.305: 63.62,20.65 DAC1.8 63.62,20.55 61.75,20.55 61.75,12.36 DAC1-DB.1
  Bottom 0.254: 52.55,24.35 27.1,24.3 v25.15,26.25
  Bottom 0.305: DAC1-DB.1 52.55,12.36 52.55,24.35
DAC1-DB1  (via drill 0.5)
  Top 0.254: U$1.9 24.81,24.66 v26.4,26.25
  Top 0.305: DAC1-DB.2 61.15,14.9 61.15,21.85 63.62,21.85 DAC1.7
  Bottom 0.254: v26.4,26.25 27.8,24.85 53.15,24.85
  Bottom 0.305: 53.15,24.85 53.15,14.9 DAC1-DB.2
DAC1-DB2  (via drill 0.5)
  Top 0.254: U$1.10 25.56,24.16 v27.65,26.25
  Top 0.305: DAC1-DB.3 60.55,17.44 60.55,23.15 DAC1.6
  Bottom 0.254: v27.65,26.25 28.55,25.35 53.75,25.35
  Bottom 0.305: 53.75,25.35 53.75,17.44 DAC1-DB.3
DAC1-DB3  (via drill 0.5)
  Top 0.254: U$1.11 26.31,23.66 v28.9,26.25
  Top 0.305: DAC1-DB.4 59.95,19.98 59.95,24.45 63.62,24.45 DAC1.5
  Bottom 0.254: v28.9,26.25 29.3,25.85 54.35,25.85
  Bottom 0.305: 54.35,25.85 54.35,19.95 56.45,19.95 DAC1-DB.4
DAC1-DB4  (via drill 0.5)
  Top 0.254: 45.55,20.25 32.39,20.25 32.27,20.33 31.85,20.75 27.55,20.75 U$1.24
  Top 0.305: v45.55,20.15 45.55,20.25 | DAC1.4 63.62,25.65 59.35,25.65 59.35,22.52 DAC1-DB.5 54.05,22.52 54.05,23.45 45.75,23.45 v45.75,23.5
  Bottom 0.305: v45.75,23.5 45.75,20.15 v45.55,20.15
DAC1-DB5  (via drill 0.5)
  Top 0.254: v28,13.7 28.05,13.7 U$1.25
  Top 0.305: v44.45,23.5 44.45,25.06 DAC1-DB.6 58.75,25.05 58.75,26.95 DAC1.3
  Bottom 0.254: 35.65,23.45 35.65,13.7 v28,13.7
  Bottom 0.305: v44.45,23.5 44.45,23.45 35.65,23.45
DAC1-DB6
  Top 0.254: U$1.37 43.55,23.16 43.55,27.15 56.5,27.15 56.5,27.6 DAC1-DB.7
  Top 0.305: DAC1-DB.7 56.45,27.65 58.75,27.65 58.75,28.23 DAC1.2
DAC1-DB7
  Top 0.254: U$1.38 42.95,23.65 42.95,30.44 56.45,30.45 DAC1-DB.8
  Top 0.305: DAC1-DB.8 58.75,30.14 58.75,29.5 DAC1.1
DAC2-DB0
  Top 0.254: 42.35,32.95 42.35,24.16 U$1.39 | DAC2-DB.1 42.36,32.96
  Top 0.305: 42.36,32.96 42.35,32.95 | DAC2-DB.1 61.55,32.96 61.55,39.35 63.62,39.35 DAC2.8
DAC2-DB1
  Top 0.254: U$1.40 41.75,24.66 41.75,35.5 DAC2-DB.2
  Top 0.305: DAC2-DB.2 60.85,35.5 60.85,40.55 63.62,40.55 DAC2.7
DAC2-DB2
  Top 0.254: U$1.51 30.55,36.04
  Top 0.305: 30.55,36.04 32.55,38.04 DAC2-DB.3 60.15,38.04 60.15,41.85 DAC2.6
DAC2-DB3
  Top 0.254: 30.05,38.58 U$1.52
  Top 0.305: 63.62,43.25 DAC2.5 63.62,43.15 59.45,43.15 59.45,40.58 DAC2-DB.4 32.05,40.58 30.05,38.58
DAC2-DB4
  Top 0.254: 29.55,41.12 U$1.53
  Top 0.305: 29.55,41.12 31.55,43.12 DAC2-DB.5 58.75,43.12 58.75,44.45 63.62,44.45 DAC2.4
DAC2-DB5
  Top 0.254: U$1.2 23.15,28.16 23.15,29.15 21.65,29.15 21.65,33.55 28.04,33.55 29.04,34.55 29.04,43.66
  Top 0.305: 29.04,43.66 31.04,45.66 DAC2-DB.6 DAC2.3
DAC2-DB6
  Top 0.254: U$1.3 21.15,27.66 21.15,34.05 27.46,34.05 28.46,35.05 28.46,46.2
  Top 0.305: 28.46,46.2 30.46,48.2 DAC2-DB.7 61.85,48.2 61.85,46.95 DAC2.2
DAC2-DB7
  Top 0.254: 27.95,48.74 27.95,35.52 26.95,34.52 20.65,34.52 20.65,27.15 U$1.4
  Top 0.305: 27.95,48.74 29.95,50.74 DAC2-DB.8 63.62,50.74 DAC2.1
DAC-CLK  (via drill 0.5, 0.6)
  Top 0.254: v38.45,28.9 38.45,27.65 34.75,27.65 34.75,27.16 U$1.45
  Top 0.305: DAC1.28 73.68,29.45 v68.85,29.45 | v68.85,48.25 68.85,48.2 DAC2.28
  Bottom 0.254: 68.85,28.9 v68.85,29.45 68.85,28.85 DAC-CLK.TP 49.1,28.9 v38.45,28.9
  Bottom 0.305: v68.85,29.45 v68.85,48.25
DAC-SLEEP  (via drill 0.5, 0.6)
  Top 0.254: v39.4,27.15 39.4,26.66 U$1.44
  Top 0.305: DAC1.15 73.68,13.05 v69.85,13.05 | v69.85,31.75 69.85,31.7 DAC2.15
  Bottom 0.254: 69.85,28.05 69.85,26.35 39.4,26.35 v39.4,27.15
  Bottom 0.305: v69.85,13.05 69.85,28.05 v69.85,31.75
GND  (via drill 0.3, 0.4, 0.5, 0.6)
  Top 0.254: 19.7,22.65 20.05,22.65 20.56,23.16 U$1.12 | C18.1 22.8,18.25 24.55,18.25 U$1.18 24.55,23.16 U$1.12 | 32.95,17.6 C21.2 | U$1.12 29.8,23.16 29.8,28.65 v29.25,29.1 | 24.55,29.25 U$1.63 24.55,31.35 25.15,31.95 C16.1 | 95.1,33.45 v90.6,33.45 | C45.1 5.25,16.15 5.25,16.05 | U$3.EXPOSED-PAD 93.26,10.65 93.26,10.7 | 93.26,10.7 U$3.17 | 93.26,10.7 93.45,10.65 93.45,9.9 U$3.10 | C_I.1 89.95,19.55 C_P.1 | IQ_MOD.EXP 108.95,10.38 IQ_MOD.10 | 73.68,25.65 DAC1.25 76.3,25.7 C24.1 | DAC2.26 DAC2.25 75.8,44.4 C26.1 | C26.1 75.9,44.55 | C26.1 75.55,44.55 75.55,44.6 75.8,44.6 C27.1 | C26.1 C11.2 77.85,44.6 79.15,44.6 79.15,40.6 R6.1 | C24.1 C25.1 | C24.1 C9.2 79.25,25.8 79.25,21.85 R3.2 | 91.25,11.55 U$3.21 91.26,13.9 | C1.1 91.26,13.9 | U$3.23 90.6,11.85 91.1,11.5 v91.25,11.5 | 91.26,13.9 90.4,13.9 v90.2,13.7 | C31.2 84.35,10.7
  Top 0.305: 19.7,22.65 C20.1 19.55,22.45 | S1.3 40.45,10.65 | DAC1.20 | C12.1 76.35,14.27 | C13.1 76.15,32.97 | DAC2.20 | 11.05,27.25 11.25,27.25 | v25,29.1 24.55,29.25 | C17.1 34.65,30.8 34.65,34.95 USART1.1 | IQ_MOD.6 108.62,10.7 IQ_MOD.EXP | IQ_MOD.EXP 108.5,9.75 107,9.75 IQ_MOD.4 | IQ_MOD.EXP 108.8,11.05 107,11.05 IQ_MOD.2 | IQ_MOD.EXP 108.9,11.75 108.6,12.05 108.6,12.65 IQ_MOD.15 | R13.1 5.25,33.65 5.25,33.7 | 83.7,34.95 R12.1 | 86.53,32.3 86.53,32.25
  Top 0.406: C3.2 C2.2 | U$4.1 86.53,32.25 86.53,32.45 | 86.53,32.45 86.53,33.45 v90.6,33.45 | v90.5,31.2 U$5.1 | DAC2.21 DAC2.20 | DAC1.21 DAC1.20 | SWD-HEADER.3 11.05,26 | RESET.4 RESET.3 12.45,14.05 12.45,12.4 | C32.2 v89.35,5.5 | v91.25,11.5 91.25,11.55 | R12.1 84,35.35 IC1.2 84,32.45 86.53,32.45
  Top 0.61: DAC1.25 DAC1.26 67.2,26.96 | 67.2,19.35 DAC1.20 | 67.2,14.27 DAC1.16 76.35,14.27 | 76.15,32.97 DAC2.16 67.2,32.97 | 67.2,38.05 DAC2.20 | DAC2.26 67.2,45.66 | C17.1 33.55,30.8 32,29.3 29.25,29.3 v29.25,29.1 | 32.95,17.6 C19.1 40.35,17.6 | 5.4,27.25 5.25,27.25 | C39.1 90.5,43.5 | 90.5,43.5 C37.1 | IC3.3 IC3.6 | 90.5,40.15 v90.6,33.45 | JP10.1 118.55,27.95 C44.2 | C38.1 90.5,40.15 | 90.5,40.15 C40.1 | 90.5,43.5 90.5,40.15
  Top 0.813: 11.25,27.25 C2.2 | C23.1 C18.1 | 19.55,22.45 11.05,22.45 11.05,26 11.05,27.25 | C35.2 15.9,42.9 | 15.9,42.9 15.9,43.5 18.24,43.5 | 18.24,43.5 19,43.5 19,43.51 3V3-REG.1 18.24,43.5 | 15.9,42.9 C36.2 13.95,45.97 13.83,45.97 | 18.24,43.5 v18.25,45.4 | 5.25,27.1 5.25,33.7 5.25,45.97 JP5.1 JP11.1 13.83,45.97 | 13.83,45.97 JP3.1
  Top 1.016: 67.2,45.66 67.2,38.05 67.2,32.97 67.2,26.96 67.2,19.35 67.2,14.27 67.2,10.55 S1.3 v40.35,12.4 S2.3 40.35,17.6 | 5.25,27.25 5.25,27.1 5.25,16.05 5.25,12.4 | 5.25,12.4 8.8,12.4 | 8.8,12.4 12.45,12.4 14.25,12.4 | 14.25,12.4 v17.75,12.4 | GND.TP 14.25,12.4 | USART1.1 | GND1.TP 8.8,12.4 | GND2.TP 3.35,12.4 5.25,12.4 | C17.1 C22.2 | C43.2 112.95,24 | 112.95,24 5V-REG.1 115.3,26.44 C44.2 | JP4.1 116.82,24 112.95,24
  Bottom 0.406: v90.6,33.45 v90.5,31.2
  Bottom 0.61: v29.25,29.1 v25,29.1 | v90.5,31.2 91.35,31.2
  Bottom 0.813: v18.25,45.4 34.7,45.3 34.7,39.1
  Bottom 1.016: v17.75,12.4 v40.35,12.4 | 34.7,37.8 34.7,39.1
  other vias: 91.25,10.65 91.25,9.8 92.1,11.5 92.1,10.65 92.1,9.8 92.95,11.5 92.95,10.65 92.95,9.8 93.8,11.5 93.8,10.65 93.8,9.8 78,6 78,9 78,12 78,15 82,48 82,46 82,44 82,42 82,40 84,42 84,44 84,40 79,48 79,46 79.85,35 78,31 78,33 78,29 104.15,12.05 101.55,12.15 99.75,8.6 104.05,9 101.55,8.65 98.25,11.6 101.85,6.75 103.95,6.75 103.95,5.1 101.85,5.1 108.5,11.2 109.45,11.2 109.45,10.2 108.45,10.2 112.15,12.35 115.75,12.15 118.2,12.15 115.7,9.85 118.2,9.85 83.75,21.05 83.75,18.05 92.75,21.05 95.75,21.05 98.6,21.05 92.75,18.05 95.35,17.15 100.45,19.2 102.35,17.35 102.65,21.05 104.45,19.25 106.3,17.4 104.25,15.45 67.75,25.05 67.75,22.05 67.75,19.05 67.75,16.05 67.75,13.05 67.75,32.05 67.75,35.05 67.75,38.05 67.75,41.05 67.75,44.05 67.75,47.05 3.75,14.05 3.75,19.05 3.75,24.05 3.75,29.05 3.75,44.05 100.8,22.9 96.75,30.05 102.75,30.05 106.75,34.05 105.75,37.05 105.75,41.05 105.75,45.05 105.75,50.05 101.75,50.05 67.75,10.05 63.75,10.05 59.75,10.05 54.75,10.05 15.75,2.05 20.75,2.05 25.75,2.05 30.75,2.05 35.75,2.05 40.75,2.05 50.75,21.05 37.75,18.05 40.75,18.05 84.25,10.7 116.7,8 120.1,2.2 114.85,1.75 112.1,2.2 118.4,24.25 121.75,30.15 121.75,36.15 116.75,36.15 111.75,36.15 49.03,49.4 49.03,44.54 49.03,41.84 49.03,39.14 49.03,36.98 49.03,34.28 34.99,44.54 34.99,41.93 32.83,39.14 34.99,49.4 97.25,4.05 97.25,1.55 108.55,3.95 108.55,1.6 122.65,5.45 120.1,5.45 122.75,16.65 120.5,16.65 102.95,24.8 104.6,23.15 106.35,21.4
  pour Bottom (isolate 0.406): -0.25,53.8 125.05,53.8 125.05,-0.65 -0.5,-0.65 -0.5,7.95
  pour Top (isolate 0.406): -0.75,54 125,54 125,-1 -0.5,-1
I_BUF
  Top 0.305: R4.1 85.05,43.5 I_BUF.TP 85.05,47.63 IC2.2
  Top 0.61: IC2.2 IC2.1
LO
  Top 0: 102.7,11.15 106.55,10.55 | 102.7,9.7 106.55,10.2
  Top 0.254: C5.2 102.65,10.4 103,10.4 IQ_MOD.3
  Top 0.406: LO.1 102.9,10.4 103,10.4
  pour Top (no thermals): 102.2,11.15 102.7,11.15 arc-17 104.75,10.85 arc14 106.55,10.55 arc5 106.75,10.55 arc-185 106.75,10.2 arc5 106.55,10.2 arc11 104.75,9.95 arc-10 102.7,9.65 arc-6 102.25,9.65
N$1
  Top 0.254: 94.21,15.15 U$3.15 | 88.95,11.1 89.15,10.9 U$3.25
  Top 0.406: 94.21,15.15 C_P.2 R_Z.1 87.7,13 | 87.7,13 87.7,11.1 88.95,11.1 | TUNE.TP 87.7,13
N$2
  Top 0.254: U$3.20 U$3.19 U$3.18 | U$3.18 | U$3.18 92.75,13.35 93.25,13.35 | 93.25,13.35 93.76,13.35 U$3.16 | C1.2 93.25,13.35
N$3
  Top 0.254: 89.35,9.3 89.35,9.4 U$3.28
  Top 0.406: C7.2 88.82,8.2 89.35,8.74 89.35,9.3
N$4
  Top 0.406: C3.1 16.05,23.9 Q1.1 19.5,23.86 R2.2
N$5
  Top 0.406: C2.1 Q1.2 R1.2
N$6
  Top 0.254: U$1.5 19.5,26.66 R1.1
N$7
  Top 0.254: R2.1 19.5,26.16 U$1.6
N$8
  Top 0: 95.3,10.5 97.75,10.75 | 98.65,10.7 99.45,11.15 | 98.65,10.05 99.55,9.65 | 95.4,10.3 97.75,10.05
  Top 0.254: C5.1 L1.2 U$3.11
  pour Top (no thermals): 95,10.45 95.3,10.5 arc-7 97.75,10.75 arc-184 97.75,10.05 arc-8 95,10.35 arc-159
  pour Top (no thermals): 98.45,10.75 98.65,10.75 arc48 99.1,10.95 arc-43 99.5,11.15 arc-190 99.5,9.65 arc-43 99.1,9.85 arc48 98.65,10.05 98.5,10.05
N$10
  Top 0.254: C4.2 R7.2
N$11
  Top 0.305: C13.2 76.15,34.23
  Top 0.61: 76.15,34.23 DAC2.17
N$12
  Top 0.305: C8.1 76.35,18.45
  Top 0.61: 76.35,18.45 75.45,18.45 75.45,18.07 DAC1.19
N$13
  Top 0.305: 73.68,15.5 DAC1.17
  Top 0.61: C12.2 73.68,15.5
N$14
  Top 0.254: DAC1.22 75.95,21.89 R3.1 75.9,21.85 75.9,20.4 80.85,20.4 80.85,50.65
  Top 0.305: 80.85,50.65 90.15,50.65 90.15,46.37
  Top 0.406: 90.15,46.37 IC2.3
N$15
  Top 0.305: U$4.4 88.5,31.2 88.5,28.5 85.75,28.5 JP6.2
N$16
  Top 0.305: S1.1 37.95,11.6 RS1.1
N$17
  Top 0.305: S1.2 38.15,9.55 RS2.1
N$18
  Top 0.305: S2.1 38,16.1 RS3.1
N$19
  Top 0.305: S2.2 38,14.05 RS4.1
N$20
  Top 0.305: C10.1 76.15,37.65
  Top 0.61: 76.15,37.65 75.36,37.65 75.15,37.44 75.15,37.19 74.73,36.77 DAC2.19
N$21
  Top 0.254: C6.2 88.83,9.9 U$3.27
N$22
  Top 0.254: 10MHZ.3 85.64,9.56 C6.1
N$23
  Top 0.254: C_I.2 R_Z.2
N$24
  Top 0.254: C9.1 78.25,24.1 78.25,23.1 73.68,23.1 DAC1.23
  Top 0.305: DAC1.23 73.72,23.2
N$25
  Top 0.254: DAC2.23 77.85,41.85 C11.1
N$26
  Top 0.254: 31.05,15.85 U$1.31
  Top 0.305: C21.1 31.05,15.85
N$27
  Top 0.254: U$1.47 37,28.16 C22.1
N$28  (via drill 0.6)
  Top 0.305: U$4.5 v89.45,35.3
  Bottom 0.305: v89.45,35.3 88.5,35.3 88.5,28.5 89.1,28.5 JP7.1
N$29
  Top 0.254: DAC2.22 75.95,40.59 R6.2 75.9,39.35 80.25,39.35 80.25,51.75
  Top 0.305: 80.25,51.75 91.15,51.75 91.15,45.1
  Top 0.406: IC2.5 91.15,45.1 | DAC2.22 73.68,40.5
N$30  (via drill 0.4)
  Top 0.254: U$3.22 90,12.55 v89.05,13.5
  Bottom 0.254: R8.1 v89.05,13.5
N$31
  Top 0.61: R9.1 R4.2 C37.2
N$32
  Top 0.406: U$4.8 86.53,38.45 R9.2
  Top 0.61: C38.2 R9.2
N$33
  Top 0.305: U$3.14 94.91,13.7 C34.1
N$34
  Top 0.406: IC3.4 99.19,48 C41.-
N$35
  Top 0.61: R10.1 R5.2 C39.2
N$36
  Top 0.406: U$5.8 92.53,38.45 92.65,38.45
  Top 0.61: R10.2 92.65,38.45 C40.2
N$37
  Top 0.406: IC3.2 101.73,48 C41.+
N$38
  Top 0.813: JP1.1 22.7,35.75 22.7,41.15 | 22.7,41.15 25.75,41.15 3V3-REG.4 | 22.7,41.15 22.7,41.2 3V3-REG.2 C35.1
N$39  (via drill 0.6)
  Top 0.305: U$5.5 94.47,36.15 v95.45,36.15
  Bottom 0.305: v95.45,36.15 94.45,36.15 94.45,28.5 96.95,28.5 JP8.2
N$40
  Top 0.305: U$5.4 94.45,31.2 94.45,28.5 93.6,28.5 JP9.1
N$42
  Top 0.305: R12.2 R11.1
  Top 0.406: IC1.1 84.95,35.35 R12.2
NRST  (via drill 0.5)
  Top 0.254: v14.95,25.25 18.1,25.25 18.1,24.85 20.8,24.85 20.8,25.66 U$1.7 | C45.2 8.53,16.15 RESET.1
  Top 0.813: RESET.2 v13.85,18.55 RESET.1
  Bottom 0.305: 13.85,25.25 13.85,31.08 SWD-HEADER.5 | 13.85,25.25 v14.95,25.25 | 13.85,25.25 v13.85,18.55
PLL-STAT  (via drill 0.6)
  Top 0.254: U$1.16 21.75,21.16 v21.75,20.05 | 69.3,4 91.71,4 U$3.3 | v16.25,9.4 16.2,4.4
  Top 0.305: 16.2,4.4 53.7,4.4 53.7,4 69.3,4
  Bottom 0.305: v21.75,20.05 16.25,20.05 v16.25,9.4
POWER-IN  (1 unrouted)
  Top 0.61: JP10.2 118.55,30.2 115.3,30.2
  Top 0.813: 3V3-REG.3 13.95,38.89 C36.1 | C36.1 12.45,41.2 12.45,43.43 JP11.2 JP5.2 | 14,41.2 C36.1
  Top 1.016: C44.1 115.3,30.2 115.3,31.06 5V-REG.3
Q_BUF
  Top 0.305: 94.3,43.5 R5.1
  Top 0.61: IC2.7 IC2.6 95.4,46.37 | 95.4,46.37 95.4,43.5 R5.1 | Q_BUF.TP 95.4,49.15 95.4,46.37
RF+
  Top 0.254: U$3.12 95.15,10.9 arc45 95.92,11.22 L2.2
  Top 0.61: L2.2 C4.1
RF-MOD
  Top 0.406: IQ_MOD.11 110.95,11 RF-MOD.1
SPI1-CS
  Top 0.254: U$1.20 25.55,12.65 22.5,12.65 SPI1-DEBUG.1
SPI1-MISO
  Top 0.254: U$1.22 26.55,12.15 27.58,12.15 SPI1-DEBUG.3
SPI1-MOSI
  Top 0.254: U$1.23 27.05,12.65 30.12,12.65 SPI1-DEBUG.4
SPI1-SCK
  Top 0.254: U$1.21 26.05,12.15 25.04,12.15 SPI1-DEBUG.2
SPI2-CS  (via drill 0.6)
  Top 0.254: v43.55,2.95 43.55,3.9 52.95,3.9 52.95,3.45 92.2,3.45 92.21,3.9 U$3.4 | U$1.33 46.29,21.16 46.6,20.85 46.6,19.15 43.62,19.15 SPI2-DEBUG.1
  Bottom 0.254: SPI2-DEBUG.1 43.55,17.02 v43.55,2.95
SPI2-MISO  (via drill 0.5)
  Top 0.254: U$1.35 46.75,22.16 47.75,21.16 47.75,18.55 48.7,18.55 SPI2-DEBUG.3 | v48.7,1.8 48.7,1.45 52.45,1.45 52.45,1.85 93.71,1.85 U$3.7
  Bottom 0.254: v48.7,1.8 SPI2-DEBUG.3
SPI2-MOSI  (via drill 0.6)
  Top 0.254: U$1.36 47,22.66 48.35,21.31 48.35,19.15 51.24,19.15 SPI2-DEBUG.4 | v51.24,2.4 93.21,2.4 U$3.6
  Bottom 0.254: v51.24,2.4 SPI2-DEBUG.4
SPI2-SCK  (via drill 0.6)
  Top 0.254: v46.11,2.95 50.2,2.95 50.2,3.35 52.45,3.35 52.45,2.95 92.71,2.95 U$3.5 | U$1.34 46.54,21.66 47.15,21.05 47.15,18.55 46.16,18.55 SPI2-DEBUG.2
  Bottom 0.254: v46.11,2.95 SPI2-DEBUG.2
STAT1-GR
  Top 0.254: U$1.26 28.55,14.52 29.82,13.25 33.25,13.25 33.25,9.35 RS2.2
STAT1-RE
  Top 0.254: U$1.27 29.05,14.81 30.11,13.75 33.75,13.75 33.75,11.65 RS1.2
STAT2-GR
  Top 0.254: U$1.28 29.55,15.03 30.33,14.25 34.8,14.25
  Top 0.305: 34.8,14.25 RS4.2
STAT2-RE
  Top 0.254: U$1.29 30.05,15.25 30.55,14.75 33.85,14.75 33.85,16.1 RS3.2
SWCLK  (via drill 0.5)
  Top 0.254: v31.55,32.35 U$1.49
  Bottom 0.305: SWD-HEADER.2 6.05,23.46 6.05,32.35 11.3,32.35 11.3,33.5 31.55,33.5 v31.55,32.35 31.55,32.3
SWDIO  (via drill 0.5)
  Top 0.254: v31.95,27.66 U$1.46
  Top 0.305: v31.95,27.65 v31.95,27.66 | v19.45,30.35 10.85,30.35 10.85,28.54 SWD-HEADER.4
  Bottom 0.305: v19.45,30.35 31.85,30.35 31.85,27.65 v31.95,27.65
USART1_RX
  Top 0.254: U$1.43 40.5,26.16 40.5,34.95 USART1.3
USART1_TX
  Top 0.254: USART1.2 37.25,37.05 41.15,37.05 41.15,25.66 U$1.42

### Text on the board
Document: Lynx Experimental Radio | Dev Board: r1 | DB7 | GND | Joe Roberts - Jul2013 | GND | STM-TX | STM-RX | DB0 | DB7 | GND | CS | CLK | MISO | MOSI | DB0 | CS | CLK | MISO | MOSI | TXCO